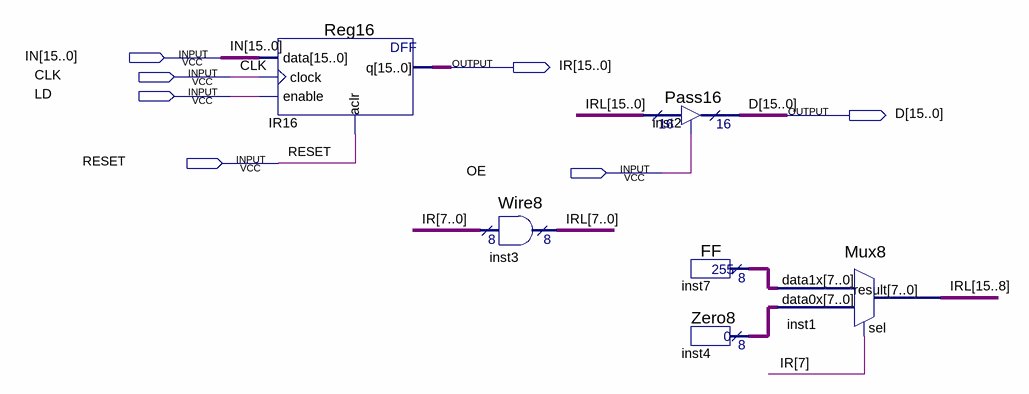
[diagram p0: schematic sheet]
// Quartus schematic IRReg.bdf as structural Verilog: 6 symbols, 7 pins
module IRReg (
  input  [15:0] IN,
  input  CLK,
  input  LD,
  input  RESET,
  input  OE,
  output [15:0] IR,
  output [15:0] D
);

  wire [7:0] inst4_result, inst7_result;
  wire [15:0] IRL;

  Reg16 IR16 (.data(IN), .clock(CLK), .enable(LD), .aclr(RESET), .q(IR));
  Wire8 inst3 (.data0x(IR[7:0]), .result(IRL[7:0]));
  Pass16 inst2 (.enabledt(OE), .data(IRL), .tridata(D));
  FF inst7 (.result(inst7_result));
  Zero8 inst4 (.result(inst4_result));
  Mux8 inst1 (.data1x(inst7_result), .data0x(inst4_result), .sel(IR[7]), .result(IRL[15:8]));
endmodule
